# Altium schematic sheet FLS Clock_A Distribution.SchDoc
size 558 x 401 mm; Organization: Carnegie Institution of Washington; SheetNumber: 0; SheetTotal: 0; PageSetup: Record=PageOptions|CenterHorizontal=True|CenterVertical=True|PrintScale=0.47|XCorrection=1.00|YCorrection=1.00|PrintKind=0|BorderSize=5000000|LeftOffset=0|BottomOffset=0|Orientation=2|PaperLength=1000|PaperWidth=1000|Scale=100|PaperSource=259|PrintQuality=600|MediaType=1|DitherType=10|PaperKind=Letter (8.5 x 11")|PrintScaleMode=1
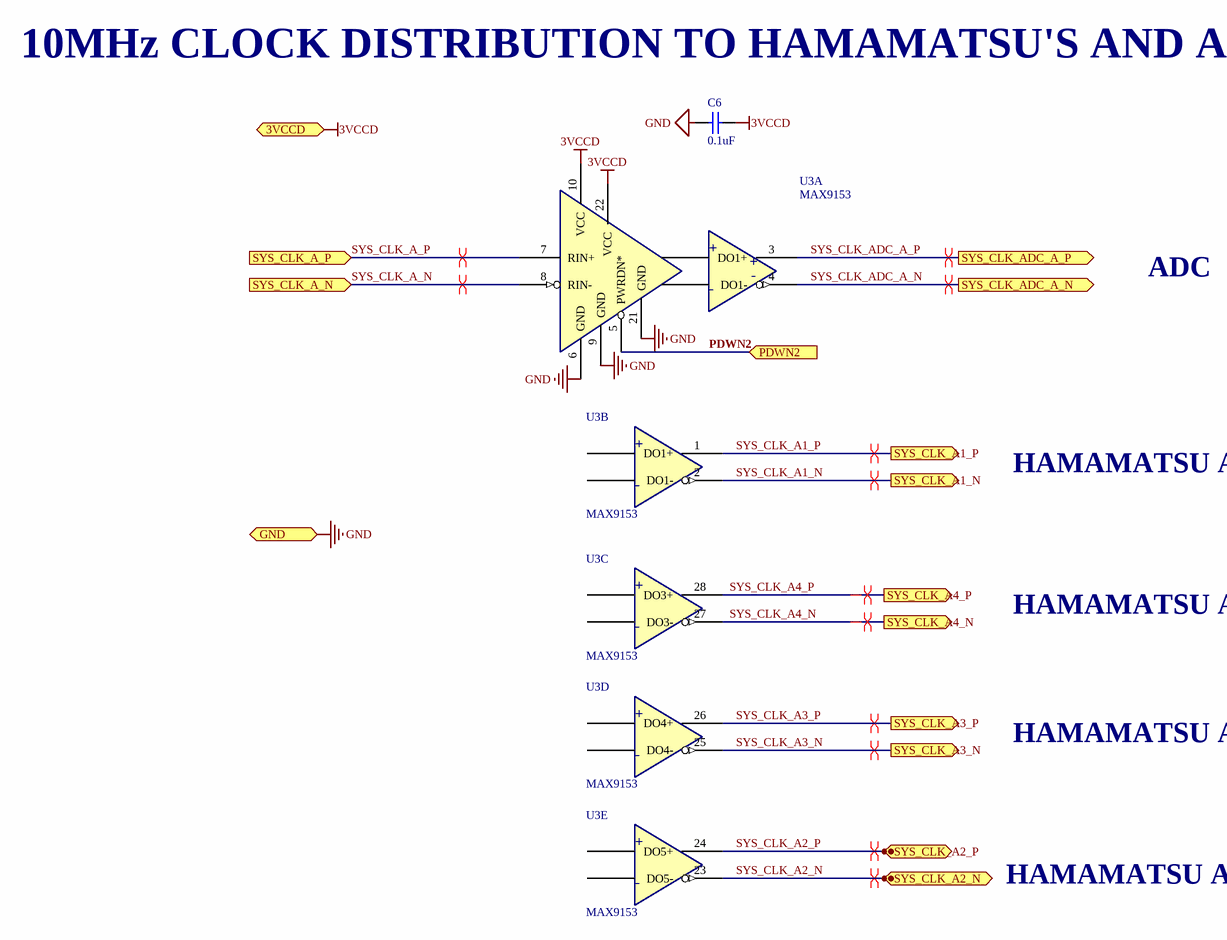
[diagram p0: FLS Clock_A Distribution.SchDoc]

## Parts
C6  0.1uF  [0805 slim]
U3  MAX9153  [MAX9153EUI]  (parts A,B,C,D,E of 10)

## Ports
3VCCD (in), GND (in), PDWN2 (in), SYS_CLK_A1_N (out), SYS_CLK_A1_P (out), SYS_CLK_A2_N (out), SYS_CLK_A2_P (out), SYS_CLK_A3_N (out), SYS_CLK_A3_P (out), SYS_CLK_A4_N (out), SYS_CLK_A4_P (out), SYS_CLK_A_N (in), SYS_CLK_A_P (in), SYS_CLK_ADC_A_N (out), SYS_CLK_ADC_A_P (out)

## Nets
3VCCD: C6.2 U3.10(VCC) U3.22(VCC) ; port 3VCCD
GND: C6.1 U3.6(GND) U3.9(GND) U3.21(GND) ; port GND
PDWN2: U3.5(PWRDN*) ; port PDWN2
SYS_CLK_A1_N: U3.2(DO1-) ; port SYS_CLK_A1_N
SYS_CLK_A1_P: U3.1(DO1+) ; port SYS_CLK_A1_P
SYS_CLK_A2_N: U3.23(DO5-) ; port SYS_CLK_A2_N
SYS_CLK_A2_P: U3.24(DO5+) ; port SYS_CLK_A2_P
SYS_CLK_A3_N: U3.25(DO4-) ; port SYS_CLK_A3_N
SYS_CLK_A3_P: U3.26(DO4+) ; port SYS_CLK_A3_P
SYS_CLK_A4_N: U3.27(DO3-) ; port SYS_CLK_A4_N
SYS_CLK_A4_P: U3.28(DO3+) ; port SYS_CLK_A4_P
SYS_CLK_A_N: U3.8(RIN-) ; port SYS_CLK_A_N
SYS_CLK_A_P: U3.7(RIN+) ; port SYS_CLK_A_P
SYS_CLK_ADC_A_N: U3.4(DO1-) ; port SYS_CLK_ADC_A_N
SYS_CLK_ADC_A_P: U3.3(DO1+) ; port SYS_CLK_ADC_A_P

## Layout directives
differential pair: SYS_CLK_A1_N, SYS_CLK_A1_P, SYS_CLK_A2_N, SYS_CLK_A2_P, SYS_CLK_A3_N, SYS_CLK_A3_P, SYS_CLK_A4_N, SYS_CLK_A4_P, SYS_CLK_A_N, SYS_CLK_A_P, SYS_CLK_ADC_A_N, SYS_CLK_ADC_A_P

## Notes on the sheet
- 10MHz CLOCK DISTRIBUTION TO HAMAMATSU'S AND ADC
- ADC
- HAMAMATSU A1
- HAMAMATSU A4
- HAMAMATSU A3
- HAMAMATSU A2
- Carnegie Institution of Washington
- 813 Santa Barbara Street
- The Observatories
- PHONE (626) 577-1122               FAX (626) 795-8136
- Pasadena, California 91101
- Title:
- OCIW
- Size:
- Date:
- C
- Scale:
- Drawn By:
- Checked By:
- A. BAGISH
- alanb
- Revision:
- Sheet          of
- File:
- (in symbol MAX9153, part A) +; -
- (in symbol MAX9153, part B) +; -
- (in symbol MAX9153, part C) +; -
- (in symbol MAX9153, part D) +; -
- (in symbol MAX9153, part E) +; -

## Library data of the parts
C6 = Cap: Capacitor; Murata Electronics North America: GRM216F51E104ZA01D; Published: 8-Jun-2000; LatestRevisionDate: 17-Jul-2002; LatestRevisionNote: Re-released for DXP Platform.; PackageReference: RAD-0.3; Publisher: Altium Limited; Value: 0.1uF; Digi-Key: 490-1726-2-ND; Footprint: 0805